# EAGLE design apricot (EAGLE 9.6.2)
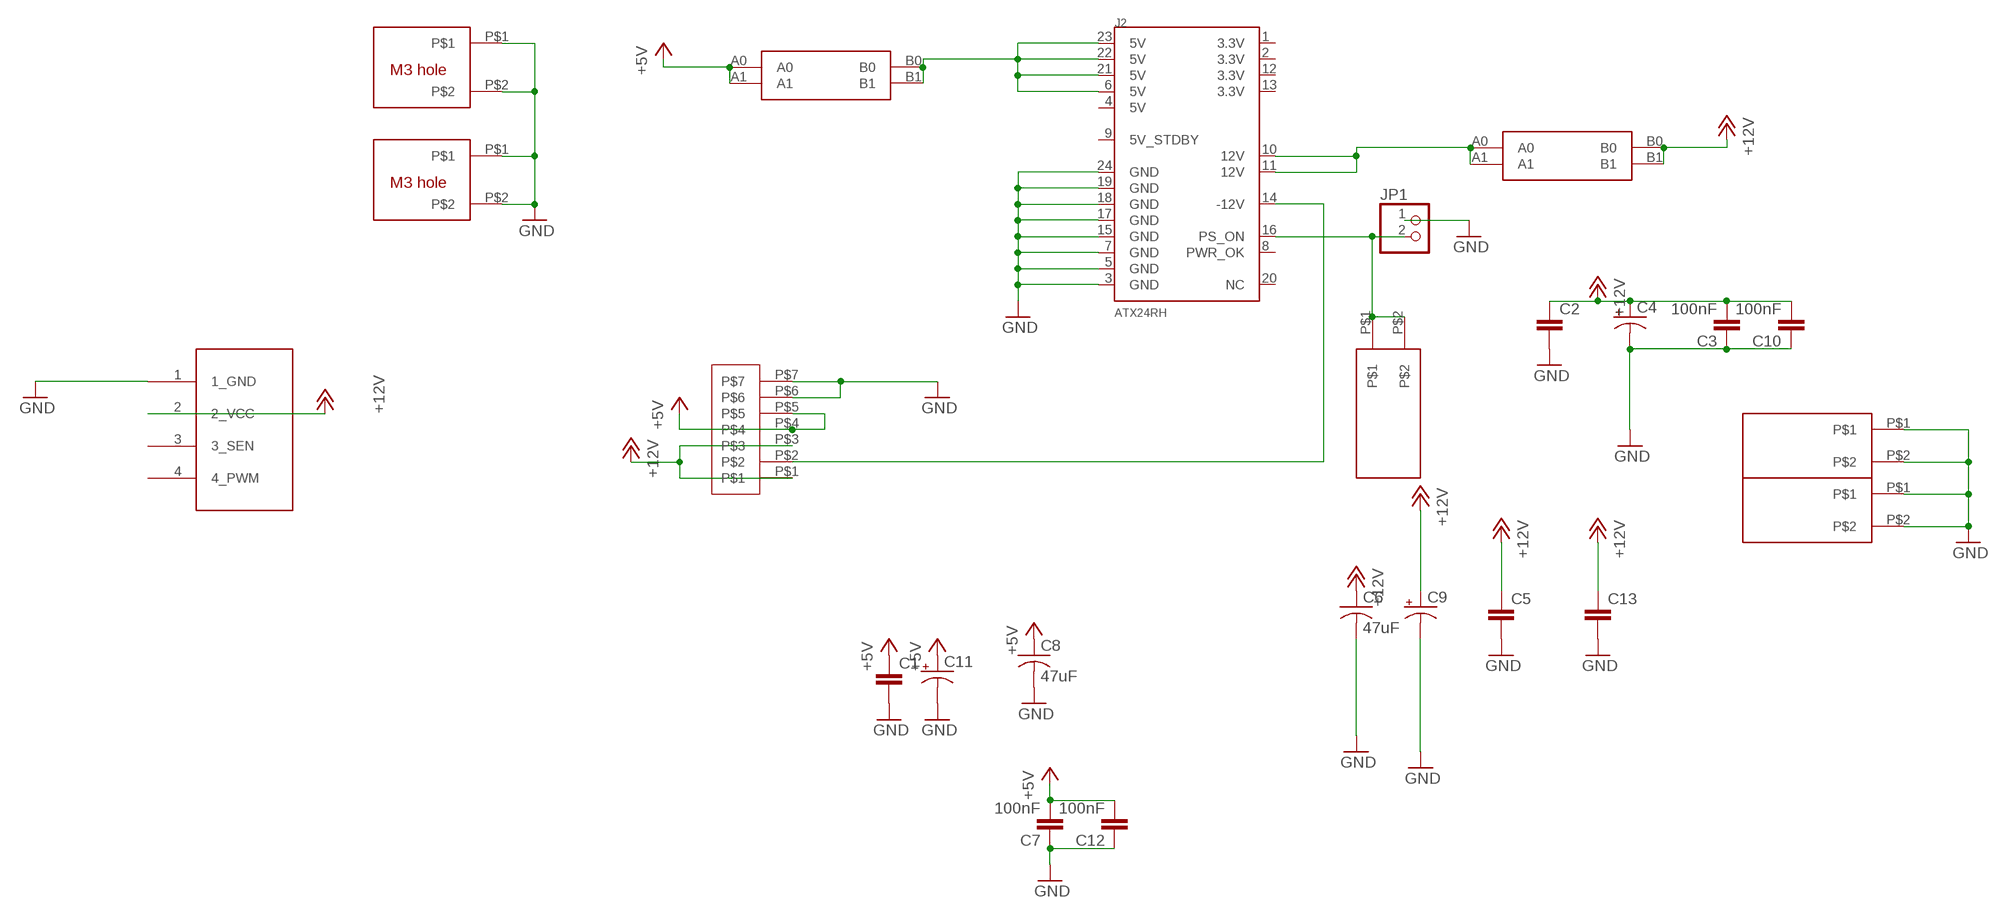
[diagram p0: schematic, sheet 1]

## Parts
C1  C5/2.5  [C5B2.5]
C2  C5/2.5  [C5B2.5]
C3  100nF  CAP0805  [0805@1]
C4  CPOL-USE3.5-8  [E3,5-8]
C5  C5/2.5  [C5B2.5]
C6  47uF  C-USC1210  [C1210]
C7  100nF  CAP0805  [0805@1]
C8  47uF  C-USC1210  [C1210]
C9  CPOL-USE3.5-8  [E3,5-8]
C10  100nF  CAP0805  [0805@1]
C11  CPOL-USE3.5-8  [E3,5-8]
C12  100nF  CAP0805  [0805@1]
C13  C5/2.5  [C5B2.5]
J2  ATX24RH  [ATX24_RIGHT_ANGLE]
JP1  PINHD-1X2  [1X02]
JP3  4PIN_FAN  [1X04]
U$1  6MM_BLADE  [6.2MMBLADE]
U$2  CAR_FUSE_HOLDER3IN1  [FUSE_HOLDER_3IN1]
U$3  6MM_BLADE  [6.2MMBLADE]
U$4  VH396  [396_7P]
U$5  M3_MOUNTING_HOLE  [M3_MOUNTING_HOLE_PACK]
U$6  M3_MOUNTING_HOLE  [M3_MOUNTING_HOLE_PACK]
U$7  6MM_BLADE  [6.2MMBLADE]
U$8  CAR_FUSE_HOLDER3IN1  [FUSE_HOLDER_3IN1]

## Nets
+5V: C1.1 C7.2 C8.1 C11.+ C12.2 U$4.P$4 U$4.P$5 U$8.A0 U$8.A1
+12V: C2.1 C3.2 C4.+ C5.1 C6.1 C9.+ C10.2 C13.1 JP3.2(2_VCC) U$2.B0 U$2.B1 U$4.P$1 U$4.P$3
GND: C1.2 C2.2 C3.1 C4.- C5.2 C6.2 C7.1 C8.2 C9.- C10.1 C11.- C12.1 C13.2 J2.3(GND) J2.5(GND) J2.7(GND) J2.15(GND) J2.17(GND) J2.18(GND) J2.19(GND) J2.24(GND) JP1.1 JP3.1(1_GND) U$3.P$1 U$3.P$2 U$4.P$6 U$4.P$7 U$5.P$1 U$5.P$2 U$6.P$1 U$6.P$2 U$7.P$1 U$7.P$2
N$1: J2.16(PS_ON) JP1.2 U$1.P$1 U$1.P$2
N$2: J2.14(-12V) U$4.P$2
N$6: J2.6(5V) J2.21(5V) J2.22(5V) J2.23(5V) U$8.B0 U$8.B1
N$8: J2.10(12V) J2.11(12V) U$2.A0 U$2.A1
Unconnected: J2.1(3.3V) J2.2(3.3V) J2.4(5V) J2.8(PWR_OK) J2.9(5V_STDBY) J2.12(3.3V) J2.13(3.3V) J2.20(NC) JP3.3(3_SEN) JP3.4(4_PWM)

## Library data of the parts
C1 C2 C5 C13 = capacitor-wima:C: CAPACITOR naming: grid - package width
C3 C7 C10 C12 = clock:CAP: Capacitor Standard 0603 ceramic capacitor, and 0.1" leaded capacitor.
C4 C9 C11 = adafruit_changed:CPOL-US: POLARIZED CAPACITOR, American symbol
C6 C8 = clock:C-US: CAPACITOR, American symbol
J2 = macse:ATX24: ATX24 Pin Power Supply Connector This is a good connector for connecting a computer power supply to a PCB. It's massive, but provides many amps of power at 5V and 12V. SKU: PRT-09498
JP1 = pinhead:PINHD-1X2: PIN HEADER
JP3 = appleii:4PIN_FAN: PIN HEADER
U$1 U$3 U$7 = apricot:6MM_BLADE
U$2 U$8 = atx_power_control:CAR_FUSE_HOLDER
U$4 = 396_conn:VH396
U$5 U$6 = apricot:M3_MOUNTING_HOLE

## Board
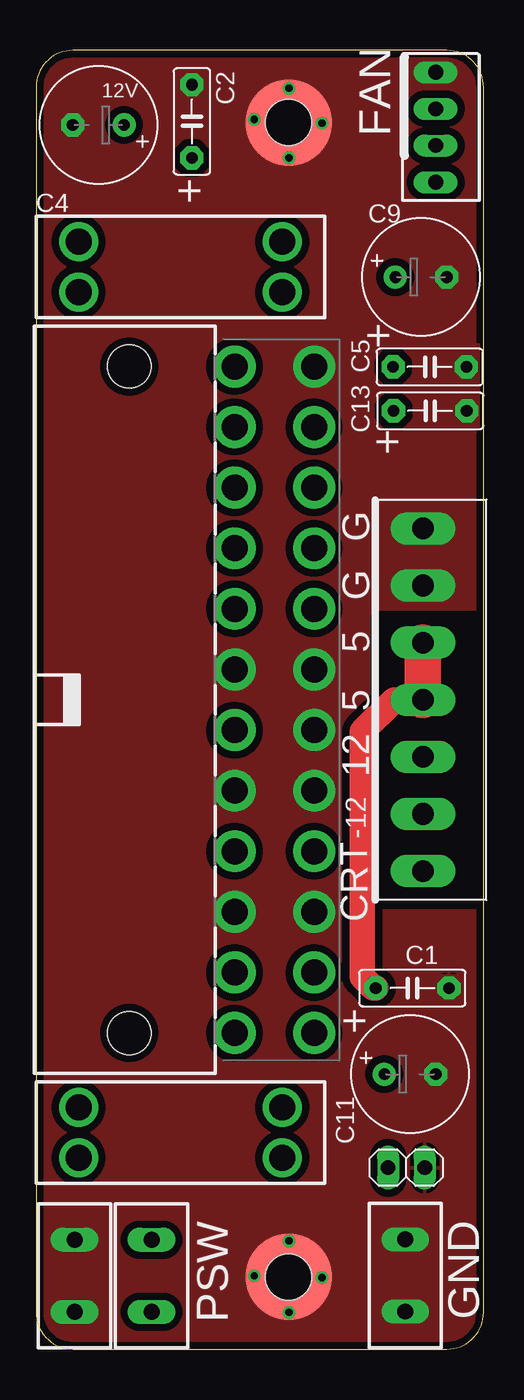
[diagram p1: board, top side]
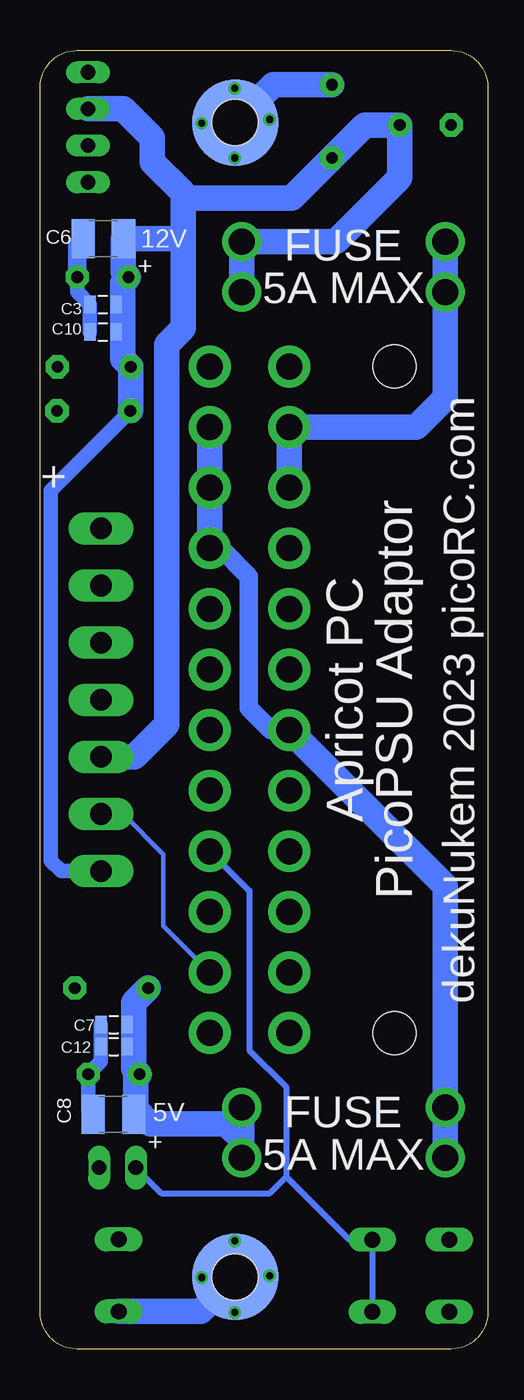
[diagram p2: board, bottom side, seen from below]

Size 31 x 90 mm. Coordinates in mm from the lower left corner, seen from the top.
Outline: 2.54,0 28.46,0 arc90 31,2.54 31,87.46 arc90 28.46,90 2.54,90 arc90 0,87.46 0,2.54 arc90 2.54,0
Copper layers (1*16): Top 0.035mm / dielectric 1.5mm / Bottom 0.035mm
Design rules "deku_2layer_6mil *": minimum track width 6mil, minimum drill 15mil, track to track 20mil, track to pad 6mil, pad to pad 6mil, via to via 6mil, smd to smd 6mil, copper to edge 10mil, drill to drill 6mil, minimum pad ring 7mil, minimum via ring 7mil, stop-mask expansion 4mil, vias tented up to drill 25mil, thermal gap 10mil
tRestrict: area 23.7,31 to 32.3,50.7

### Footprints (pad centres in the part's own frame; a part is rotated, then mirrored left to right if it is on the bottom)
C5B2.5 = drill 0.813 pad 1.6 octagon: 1 -2.54,0; 2 2.54,0
0805@1 = smd 0.8 x 1.2: 1 -0.9,0; 2 0.9,0
E3,5-8 = drill 0.813 pad 1.6: + -1.778,0 | drill 0.813 pad 1.6 octagon: - 1.778,0
C1210 = smd 1.6 x 2.7: 1 -1.4,0; 2 1.4,0
ATX24_RIGHT_ANGLE = drill 1.8 pad 2.9: 1 23.1,4.76; 2 18.9,4.76; 3 14.7,4.76; 4 10.5,4.76; 5 6.3,4.76; 6 2.1,4.76; 7 -2.1,4.76; 8 -6.3,4.76; 9 -10.5,4.76; 10 -14.7,4.76; 11 -18.9,4.76; 12 -23.1,4.76; 13 23.1,10.26; 14 18.9,10.26; 15 14.7,10.26; 16 10.5,10.26; 17 6.3,10.26; 18 2.1,10.26; 19 -2.1,10.26; 20 -6.3,10.26; 21 -10.5,10.26; 22 -14.7,10.26; 23 -18.9,10.26; 24 -23.1,10.26 | hole 3: -23.1,-2.54; 23.1,-2.54
1X02 = drill 1.016 long: 1 -1.27,0; 2 1.27,0
1X04 = drill 1.016 long: 1 -3.81,0; 2 -1.27,0; 3 1.27,0; 4 3.81,0
6.2MMBLADE = drill 1.1 long: P$1 -2.5,0; P$2 2.5,0
FUSE_HOLDER_3IN1 = drill 1.8: A0 -7.05,1.75; A1 -7.05,-1.75; B0 7.05,1.75; B1 7.05,-1.75
396_7P = drill 1.5 long: P$1 -11.88,0; P$2 -7.92,0; P$3 -3.96,0; P$4 0,0; P$5 3.96,0; P$6 7.92,0; P$7 11.88,0
M3_MOUNTING_HOLE_PACK = smd 6 x 6 bottom: P$1 0,0 | smd 6 x 6: P$2 0,0 | hole 3.2: 0,0

### Placement (x,y rotation side)
C1  26.07,25.02 0 top
C2  10.79,85.09 90 top
C3  26.67,72.39 0 bottom
C4  4.32,84.84 180 top
C5  27.27,68.07 0 top
C6  26.64,76.96 180 bottom
C7  25.91,22.48 0 bottom
C8  25.94,16.26 180 bottom
C9  26.67,74.3 0 top
C10  26.67,70.48 0 bottom
C11  25.91,19.05 0 top
C12  25.91,20.95 0 bottom
C13  27.3,65.02 0 top
J2  9,45 270 top
JP1  25.65,12.57 180 top
JP3  27.69,84.68 270 top
U$1  8,5.08 270 top
U$2  10,75 0 top
U$3  2.67,5.08 270 top
U$4  26.8,45 90 top
U$5  17.5,5 0 top
U$6  17.5,85 0 top
U$7  25.57,5.1 270 top
U$8  10,15 180 top

### Tracks (layer width: path | path; a pad name or v marks a point on that pad's centre or on a via)
+5V
  Top 1.778: U$4.P$4 24.81,45 22.61,42.8 22.61,25.78 23.37,25.02 C1.1
  Top 2.54: U$4.P$4 U$4.P$5
  Bottom 0.508: C7.2 C12.2 25.01,19.93 C11.+
  Bottom 0.61: C11.+ 24.54,18.64 C8.1
  Bottom 1.778: U$8.A1 U$8.A0 17.05,14.52 18.15,15.62 23.37,15.62 24.38,16.64 24.38,18.8 C11.+ 24.51,19.43 24.51,24.04 C1.1
+12V
  Bottom 0.508: C9.+ 25.77,73.42 C3.2 C10.2
  Bottom 1.016: U$4.P$1 29.56,33.12 30.28,33.83 30.28,59.48 24.77,64.99 C13.1
  Bottom 1.778: U$2.B1 U$2.B0 10.53,76.75 6.1,81.19 C4.+ 8.51,84.84 C2.1 13.59,79.76 21.11,79.76 | 21.11,79.76 21.11,80.14 23.24,82.26 23.24,83.95 25.24,85.95 JP3.2 | 21.11,76.71 21.11,70.74 22.26,69.6 22.26,43.27 24.49,41.04 U$4.P$3 | 21.11,76.71 21.11,79.76 | 21.11,76.71 21.37,76.96 C6.1 25.24,74.64 C9.+ 25.27,73.91 25.27,68.61 C5.1 24.73,65.06 C13.1
GND  (via drill 0.5)
  Bottom 1.016: C10.1 C3.1 28.45,73.27 C9.- | C7.1 C12.1 26.81,19.93 C11.- 27.69,16.6 C8.2
  Bottom 1.27: C6.2 28.45,76.55 C9.-
  Bottom 1.778: U$7.P$2 19.9,2.6 U$5.P$2 | U$6.P$2 14.87,87.63 C2.2
  other vias: 17.53,7.49 19.81,4.95 17.53,2.54 15.11,5.08 17.53,87.38 19.81,84.96 15.11,85.22 17.53,82.55
  pour Top (isolate 0.508): 31,90 0,90 0,-0.06 31,-0.06
  pour Top (no thermals): 1.56,86.23 3.59,86.23 3.59,83.44 1.56,83.44
  pour Top (no thermals): 9.45,88.77 12.1,88.77 12.1,86.49 9.45,86.49
  pour Top (no thermals): 27.21,75.44 30,75.44 30,73.03 27.21,73.03
  pour Top (no thermals): 26.45,20.7 28.99,20.7 28.99,17.78 26.45,17.78
  pour Top (no thermals): 27.46,25.91 30.13,25.91 30.13,24 27.46,24
  pour Top (no thermals): 28.48,69.6 31.15,69.6 31.15,63.88 28.48,63.88
N$1
  Bottom 0.406: J2.16 16.51,31.75 16.51,20.7 13.97,18.16 13.97,11.94 | 13.97,11.94 9.61,7.58 U$1.P$1 U$1.P$2 | JP1.2 22.61,10.79 15.11,10.79 13.97,11.94
N$2
  Bottom 0.305: J2.14 22.48,29.32 22.48,34.29 25.27,37.08 U$4.P$2
N$6
  Bottom 1.27: J2.21 18.5,55.5 16.54,53.54 16.54,44.41 15.03,42.9 J2.6
  Bottom 1.778: J2.23 J2.22 J2.21 | J2.6 2.95,32.09 U$8.B1 U$8.B0
N$8
  Bottom 1.778: J2.10 J2.11 4.97,63.9 2.95,65.92 U$2.A1 U$2.A0

### Text on the board
tNames: 12V | FAN | + | + | + | G | G | 5 | 5 | 12 | -12 | CRT | + | PSW | GND
bNames: 12V | FUSE / 5A MAX | + | dekuNukem 2023 picoRC.com | Apricot PC / PicoPSU Adaptor | 5V | FUSE / 5A MAX